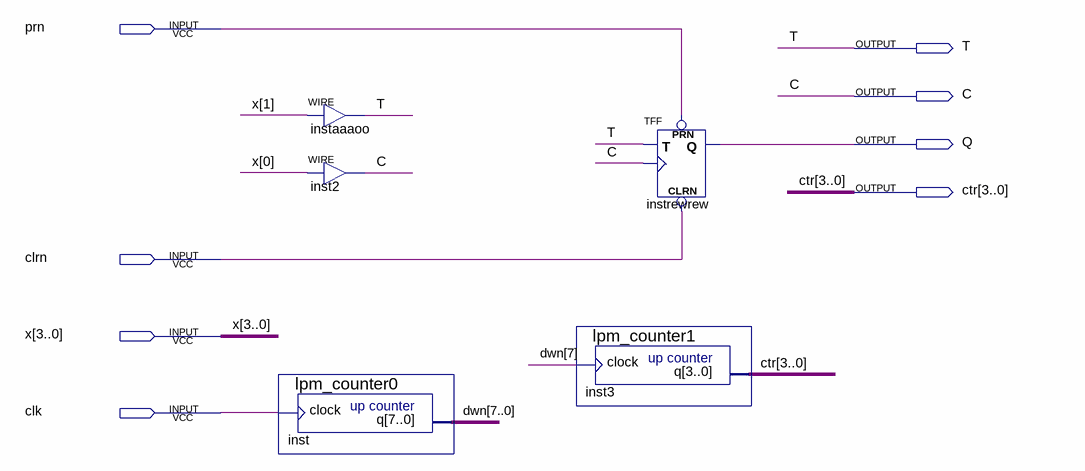
[diagram p0: schematic sheet]
// Quartus schematic lab4T.bdf as structural Verilog: 5 symbols, 8 pins
module lab4T (
  input  prn,
  input  clrn,
  input  [3:0] x,
  input  clk,
  output T,
  output C,
  output Q,
  output [3:0] ctr
);

  wire [7:0] dwn;

  lpm_counter0 inst (.clock(clk), .q(dwn));
  assign T = x[1];  // WIRE instaaaoo
  assign C = x[0];  // WIRE inst2
  lpm_counter1 inst3 (.clock(dwn[7]), .q(ctr));
  TFF instrewrew (.PRN(prn), .CLRN(clrn), .T(T), .CLK(C), .Q(Q));
endmodule
